# Altium schematic sheet 3.3V_Supply.SchDoc
size A; SheetNumber: 2; SheetTotal: 5
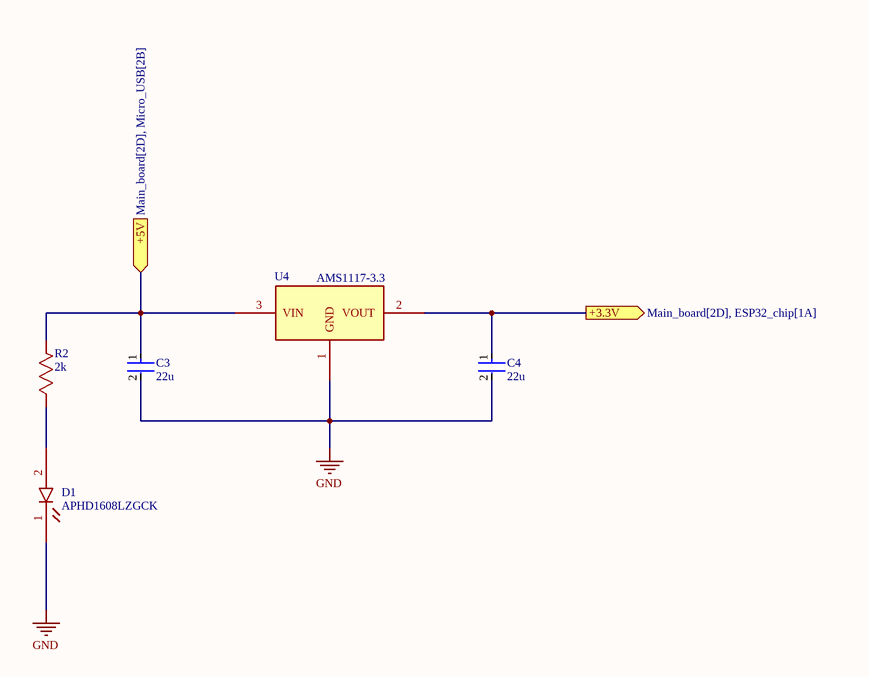
[diagram p0: 3.3V_Supply.SchDoc]

## Parts
C3  22u  [FP-GRM21B-0_15-IPC_A]
C4  22u  [FP-GRM21B-0_15-IPC_A]
D1  APHD1608LZGCK  [FP-APHD1608LZGCK-MFG]
R2  2k  [FP-CRGCQ0805-IPC_A]
U4  AMS1117-3.3  [AMS1117]

## Ports
+3.3V (out, see Main_board[2D], ESP32_chip[1A]), +5V (in, see Main_board[2D], Micro_USB[2B])

## Nets
GND: C3.2 C4.2 D1.1 U4.1(GND)
+3.3V: C4.1 U4.2(VOUT) ; port +3.3V
+5V: C3.1 R2.2 U4.3(VIN) ; port +5V
NetD1_2: D1.2 R2.1

## Library data of the parts
C3 C4 = GRM21BR61A226ME51L: 0805 22 uF 10 V ±20% Tolerance X5R SMT Multilayer Ceramic Capacitor; Manufacturer: Murata; Manufacturer Lifecycle Status: IN PRODUCTION; Value: 22µF; Voltage Rating: 10V; Supplier: DigiKey; Supplier Part Number: 490-10511-1-ND; Manufacturer Part Number: GRM21BR61A226ME51L; RoHS: Compliant; Category: Ceramic Capacitors; Stock: 246273; Pricing: 1=0.19, 10=0.111, 50=0.0788, 100=0.069, 500=0.0526, 1000=0.04756 (USD); Case/Package: 0805; Case Code (Imperial): 0805; Case Code (Metric): 2012; Depth: 1.25mm; Dielectric: X5R; Dielectric Material: Ceramic; Height: 1.25mm; Lead Free: Lead Free; Length: 2mm; Lifecycle Status: Production; Material: Ceramic; Max Operating Temperature: 85°C; Min Operating Temperature: -55°C; Mounting Technology: Surface Mount; Number of Terminals: 2; Packaging: Cut Tape; Radiation Hardening: No; REACH SVHC: Yes; Schedule B: 8532240020, 8532240020|8532240020, 8532240020|8532240020|8532240020, 8532240020|8532240020|8532240020|8532240020; Termination: SMD/SMT; Thickness: 1.25mm; Tolerance: 20%; Voltage Rating (DC): 10V; Weight: 9.49709mg; Width: 1.25mm; ComponentLink1URL: https://datasheet.octopart.com:443/GRM21BR61A226ME51L-Murata-datasheet-46741949.pdf?src-supplier=element14+APAC; ComponentLink1Description: https://datasheet.octopart.com:443/GRM21BR61A226ME51L-Murata-datasheet-46741949.pdf?src-supplier=element14+APAC; ComponentLink2URL: https://datasheet.octopart.com:443/GRM21BR61A226ME51L-Murata-datasheet-141278167.pdf?src-supplier=Geoflip; ComponentLink2Description: https://datasheet.octopart.com:443/GRM21BR61A226ME51L-Murata-datasheet-141278167.pdf?src-supplier=Geoflip; ComponentLink3URL: https://datasheet.octopart.com:443/GRM21BR61A226ME51L-Murata-datasheet-165579666.pdf?src-supplier=TME; ComponentLink3Description: https://datasheet.octopart.com:443/GRM21BR61A226ME51L-Murata-datasheet-165579666.pdf?src-supplier=TME; ComponentLink4URL: https://datasheet.octopart.com:443/GRM21BR61A226ME51L-Murata-datasheet-81455648.pdf?src-supplier=TME; ComponentLink4Description: https://datasheet.octopart.com:443/GRM21BR61A226ME51L-Murata-datasheet-81455648.pdf?src-supplier=TME; ComponentLink5URL: https://datasheet.octopart.com:443/GRM21BR61A226ME51L-Murata-datasheet-140707522.pdf?src-supplier=Ciiva; ComponentLink5Description: https://datasheet.octopart.com:443/GRM21BR61A226ME51L-Murata-datasheet-140707522.pdf?src-supplier=Ciiva; ComponentLink6URL: https://datasheet.octopart.com:443/GRM21BR61A226ME51L-Murata-datasheet-138744834.pdf?src-supplier=Ciiva; ComponentLink6Description: https://datasheet.octopart.com:443/GRM21BR61A226ME51L-Murata-datasheet-138744834.pdf?src-supplier=Ciiva; ComponentLink7URL: https://datasheet.octopart.com:443/GRM21BR61A226ME51L-Murata-datasheet-22122223.pdf?src-supplier=Future+Electronics; ComponentLink7Description: https://datasheet.octopart.com:443/GRM21BR61A226ME51L-Murata-datasheet-22122223.pdf?src-supplier=Future+Electronics; ComponentLink8URL: https://datasheet.octopart.com/GRM21BR61A226ME51L-Murata-datasheet-12515295.pdf; ComponentLink8Description: https://datasheet.octopart.com/GRM21BR61A226ME51L-Murata-datasheet-12515295.pdf; ComponentLink9URL: https://datasheet.octopart.com/GRM21BR61A226ME51L-Murata-datasheet-12510076.pdf; ComponentLink9Description: https://datasheet.octopart.com/GRM21BR61A226ME51L-Murata-datasheet-12510076.pdf; ComponentLink10URL: https://datasheet.octopart.com/GRM21BR61A226ME51L-Murata-datasheet-11978611.pdf; ComponentLink10Description: https://datasheet.octopart.com/GRM21BR61A226ME51L-Murata-datasheet-11978611.pdf; ComponentLink11URL: https://datasheet.octopart.com/GRM21BR61A226ME51L-Murata-datasheet-10025737.pdf; ComponentLink11Description: https://datasheet.octopart.com/GRM21BR61A226ME51L-Murata-datasheet-10025737.pdf; ComponentLink12URL: https://datasheet.octopart.com/GRM21BR61A226ME51L-Murata-datasheet-8819587.pdf; ComponentLink12Description: https://datasheet.octopart.com/GRM21BR61A226ME51L-Murata-datasheet-8819587.pdf; ComponentLink13URL: https://datasheet.octopart.com/GRM21BR61A226ME51L-Murata-datasheet-14402366.pdf; ComponentLink13Description: https://datasheet.octopart.com/GRM21BR61A226ME51L-Murata-datasheet-14402366.pdf; ComponentLink14URL: http://sigma.octopart.com:80/reach_statement/Murata-company-16.pdf?src-supplier=Compliance+Statements; ComponentLink14Description: http://sigma.octopart.com:80/reach_statement/Murata-company-16.pdf?src-supplier=Compliance+Statements
D1 = APHD1608LZGCK: Standard LEDs; SMD 0608 Compact Dome Lens LED; 1.6x0.8 mm; Green; (Cut Reel); Manufacturer: Kingbright; Forward Current: 20mA; Forward Voltage: 3.1V; Luminous Intensity: 50mcd; Max Junction Temperature (Tj): 110°C; Number of Circuits: 1; Peak Wavelength: 515nm; Power Dissipation: 82mW; Reverse Voltage: 5V; Shape: Round; Viewing Angle: 100°; Wavelength: 525nm; Supplier: DigiKey; Supplier Part Number: 754-2036-1-ND; Manufacturer Part Number: APHD1608LZGCK; RoHS: Compliant; Category: LEDs; Stock: 12024; Pricing: 1=0.67, 10=0.462, 100=0.3353, 500=0.27854, 1000=0.2599, 2000=0.24407 (USD); Case/Package: 0603; China RoHS: Compliant; Color: Green; Height: 650µm; Lifecycle Status: Production; Max Operating Temperature: 85°C; Min Operating Temperature: -40°C; Mounting Technology: Surface Mount; Number of Terminals: 2; REACH SVHC: Yes; Schedule B: 8541402000, 8541402000|8541402000|8541402000|8541402000|8541402000; Terminal Pitch: 1.3mm; ComponentLink1URL: https://datasheet.octopart.com:443/APHD1608LZGCK-Kingbright-datasheet-180516588.pdf?src-supplier=IHS; ComponentLink1Description: https://datasheet.octopart.com:443/APHD1608LZGCK-Kingbright-datasheet-180516588.pdf?src-supplier=IHS; ComponentLink2URL: https://datasheet.octopart.com:443/APHD1608LZGCK-Kingbright-datasheet-137333011.pdf?src-supplier=Upverter; ComponentLink2Description: https://datasheet.octopart.com:443/APHD1608LZGCK-Kingbright-datasheet-137333011.pdf?src-supplier=Upverter; ComponentLink3URL: https://datasheet.octopart.com:443/APHD1608LZGCK-Kingbright-datasheet-110729783.pdf?src-supplier=RS+(Formerly+Allied+Electronics); ComponentLink3Description: https://datasheet.octopart.com:443/APHD1608LZGCK-Kingbright-datasheet-110729783.pdf?src-supplier=RS+(Formerly+Allied+Electronics)
R2 = 1623173-1: Res Thick Film 0805 2K Ohm 1% 0.125W(1/8W) ±100ppm/C Pad SMD T/R; Manufacturer: TE Connectivity; Manufacturer Lifecycle Status: ACTIVE; Max Power Dissipation: 125mW; Number of Resistors: 1; Operating Supply Voltage: 150V; Value: 2kΩ; Temperature Coefficient: 100ppm/°C; Supplier: Newark; Supplier Part Number: 1623173-1; Manufacturer Part Number: 1623173-1; RoHS: Compliant; Category: Chip SMD Resistors; Stock: 75000; Pricing: 20000=0.005 (USD); Case/Package: 0805; Case Code (Imperial): 0805; Case Code (Metric): 2012; China RoHS: Non-Compliant; Composition: Thick Film; Depth: 1.25mm; ELV: Compliant; Height: 550µm; Length: 2mm; Lifecycle Status: Production; Max Operating Temperature: 155°C; Military Standard: Not; Min Operating Temperature: -55°C; Mounting Technology: Surface Mount; Number of Terminals: 2; Number of Terminations: 2; Packaging: Tape & Reel (TR); Power Dissipation: 125mW; Power Rating: 125mW; Radiation Hardening: No; REACH SVHC: Yes; Termination: Solder; Tolerance: 1%; Voltage Rating: 150V; Width: 1.25mm; Working Voltage: 150V; ComponentLink1URL: https://datasheet.octopart.com:443/CRG0805F2K0-TE-Connectivity-datasheet-167977698.pdf?src-supplier=IHS; ComponentLink1Description: https://datasheet.octopart.com:443/CRG0805F2K0-TE-Connectivity-datasheet-167977698.pdf?src-supplier=IHS; ComponentLink2URL: https://datasheet.octopart.com:443/1623173-1-TE-Connectivity---AMP-datasheet-11120284.pdf?src-supplier=Newark; ComponentLink2Description: https://datasheet.octopart.com:443/1623173-1-TE-Connectivity---AMP-datasheet-11120284.pdf?src-supplier=Newark; ComponentLink3URL: https://datasheet.octopart.com:443/1623173-1-TE-Connectivity---AMP-datasheet-44624597.pdf?src-supplier=Newark; ComponentLink3Description: https://datasheet.octopart.com:443/1623173-1-TE-Connectivity---AMP-datasheet-44624597.pdf?src-supplier=Newark; ComponentLink4URL: https://datasheet.octopart.com:443/1623173-1-TE-Connectivity---AMP-datasheet-128558484.pdf?src-supplier=Master+Electronics; ComponentLink4Description: https://datasheet.octopart.com:443/1623173-1-TE-Connectivity---AMP-datasheet-128558484.pdf?src-supplier=Master+Electronics; ComponentLink5URL: https://datasheet.octopart.com:443/1623173-1-TE-Connectivity---AMP-datasheet-189108518.pdf?src-supplier=Master+Electronics; ComponentLink5Description: https://datasheet.octopart.com:443/1623173-1-TE-Connectivity---AMP-datasheet-189108518.pdf?src-supplier=Master+Electronics; ComponentLink6URL: https://datasheet.octopart.com:443/1623173-1-TE-Connectivity-datasheet-14528760.pdf?src-supplier=TE+Connectivity; ComponentLink6Description: https://datasheet.octopart.com:443/1623173-1-TE-Connectivity-datasheet-14528760.pdf?src-supplier=TE+Connectivity; ComponentLink7URL: https://datasheet.octopart.com:443/CRG0805F2K0-Tyco-Electronics-datasheet-11120141.pdf?src-supplier=TE+Connectivity; ComponentLink7Description: https://datasheet.octopart.com:443/CRG0805F2K0-Tyco-Electronics-datasheet-11120141.pdf?src-supplier=TE+Connectivity; ComponentLink8URL: https://datasheet.octopart.com:443/1623173-1-TE-Connectivity-datasheet-177731334.pdf?src-supplier=Burklin+Elektronik; ComponentLink8Description: https://datasheet.octopart.com:443/1623173-1-TE-Connectivity-datasheet-177731334.pdf?src-supplier=Burklin+Elektronik; ComponentLink9URL: https://datasheet.octopart.com:443/CRG0805F2K0-TE-Connectivity-datasheet-137111065.pdf?src-supplier=X-ON; ComponentLink9Description: https://datasheet.octopart.com:443/CRG0805F2K0-TE-Connectivity-datasheet-137111065.pdf?src-supplier=X-ON; ComponentLink10URL: http://sigma.octopart.com:80/14528759/rohs_certificate/TE-Connectivity-CRG0805F2K0.pdf?src-supplier=Compliance+Statements; ComponentLink10Description: http://sigma.octopart.com:80/14528759/rohs_certificate/TE-Connectivity-CRG0805F2K0.pdf?src-supplier=Compliance+Statements; ComponentLink11URL: http://sigma.octopart.com:80/38872762/materials_sheet/TE-Connectivity-CRG0805F2K0.pdf?src-supplier=Compliance+Statements; ComponentLink11Description: http://sigma.octopart.com:80/38872762/materials_sheet/TE-Connectivity-CRG0805F2K0.pdf?src-supplier=Compliance+Statements; ComponentLink12URL: http://sigma.octopart.com:80/78339156/materials_sheet/TE-Connectivity-CRG0805F2K0.pdf?src-supplier=Compliance+Statements; ComponentLink12Description: http://sigma.octopart.com:80/78339156/materials_sheet/TE-Connectivity-CRG0805F2K0.pdf?src-supplier=Compliance+Statements